# EAGLE design NIBP_Board_v1.2.0_feb2023 (EAGLE 9.6.2)

## Sheet 1 of 4: Microcontroller
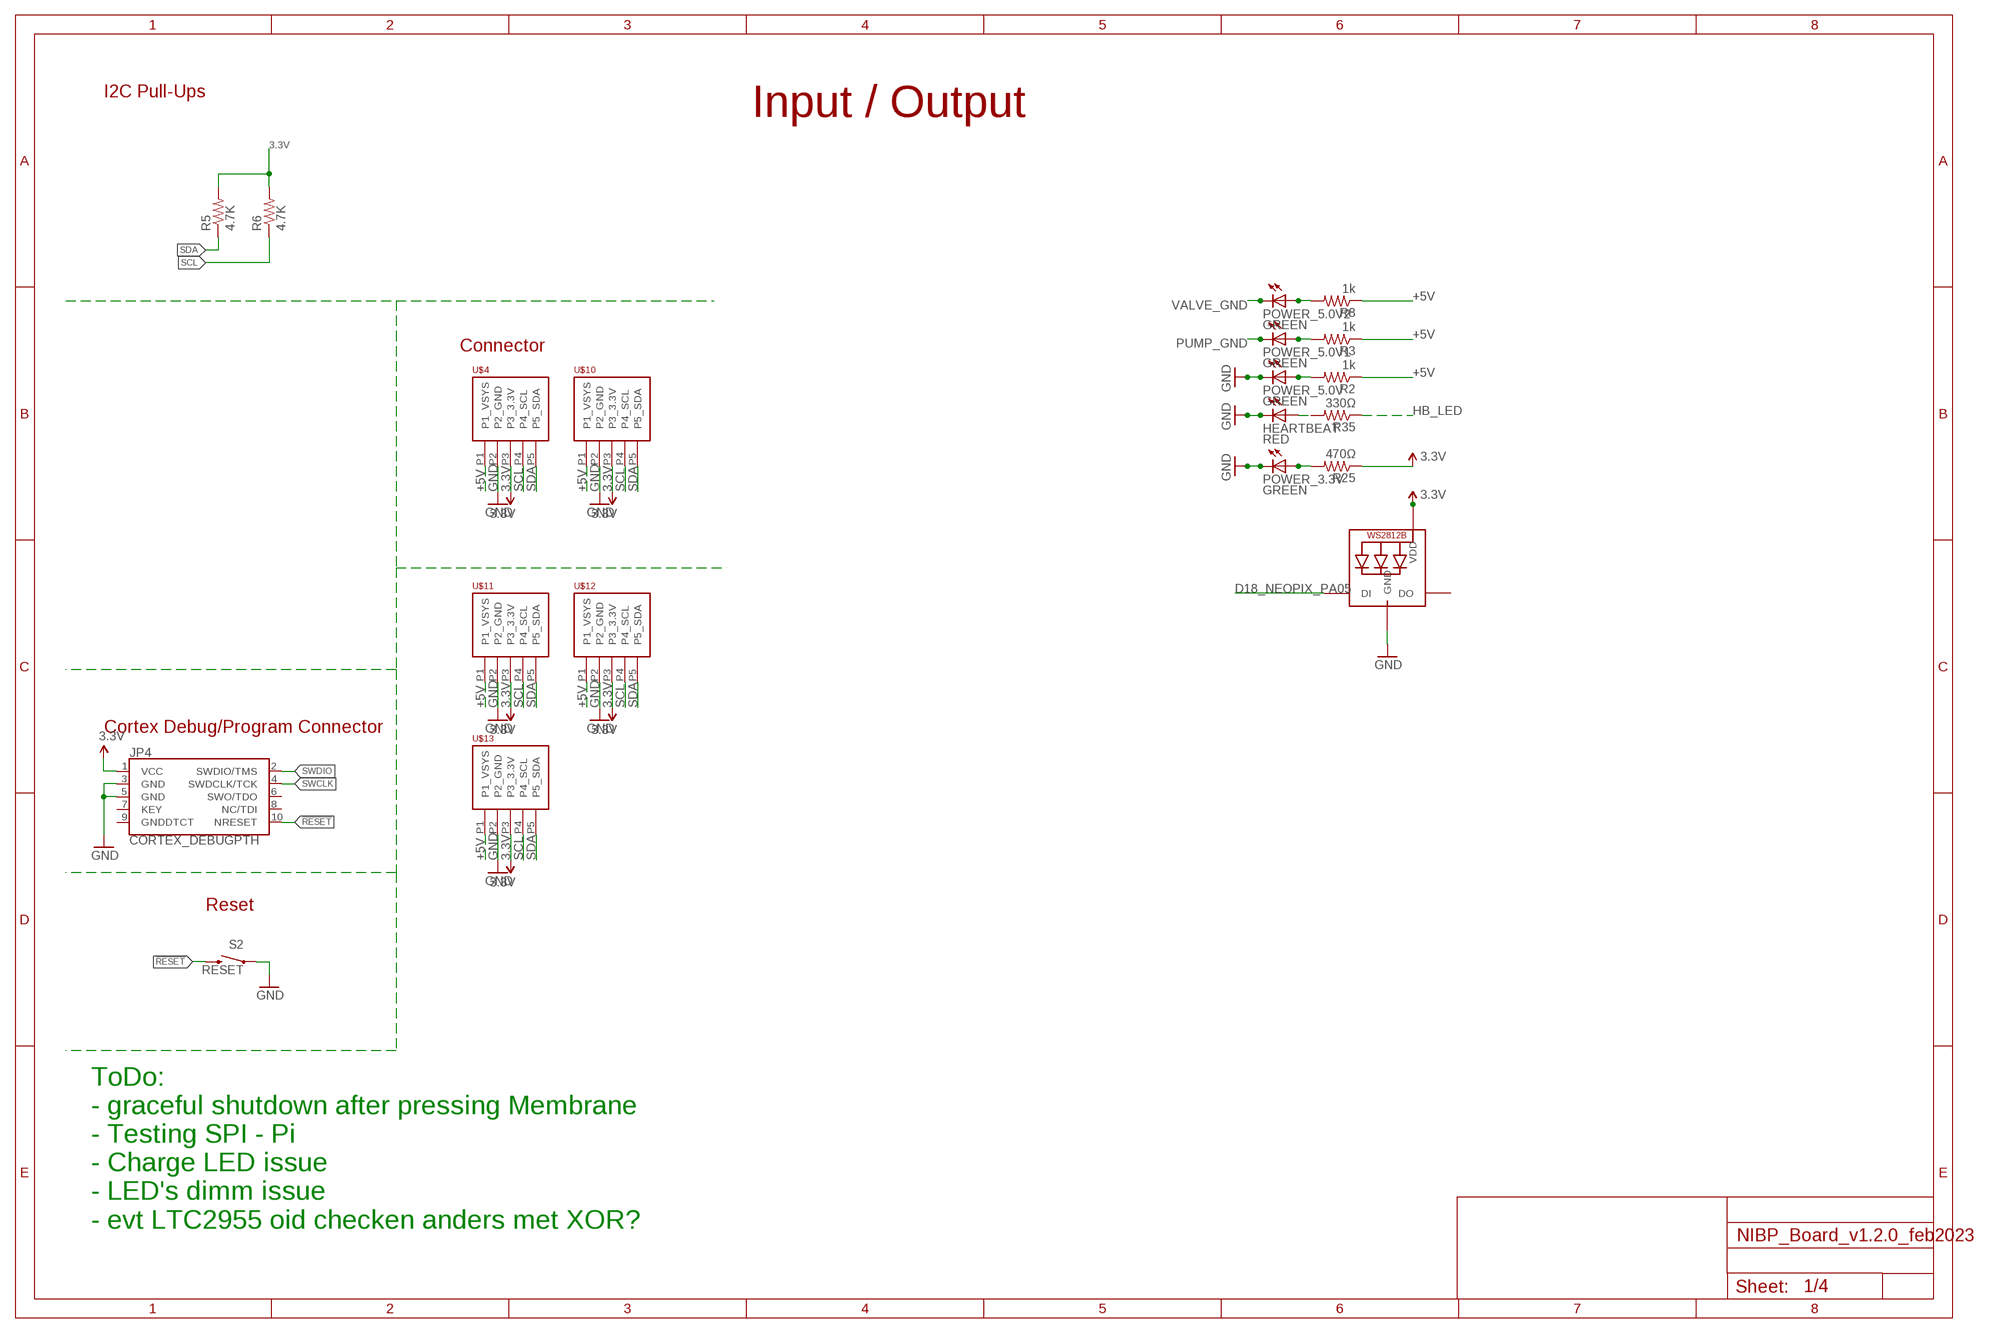
[diagram p0: schematic, sheet 1]

### Parts
HEARTBEAT  RED  LED0603  [LED-0603]
JP4  CORTEX_DEBUGPTH  [2X5-PTH-1.27MM]
LED1  WS2812B3535  [LED3535]
POWER_3.3V  GREEN  LED0603  [LED-0603]
POWER_5.0V  GREEN  LED0603  [LED-0603]
POWER_5.0V1  GREEN  LED0603  [LED-0603]
POWER_5.0V2  GREEN  LED0603  [LED-0603]
R2  1k  10KOHM-1/10W-1%(0603)0603  [0603-RES]
R3  1k  10KOHM-1/10W-1%(0603)0603  [0603-RES]
R5  4.7K  4.7KOHM-1/10W-1%(0603)  [0603-RES@1]
R6  4.7K  4.7KOHM-1/10W-1%(0603)  [0603-RES@1]
R8  1k  10KOHM-1/10W-1%(0603)0603  [0603-RES]
R25  470Ω  10KOHM-1/10W-1%(0603)0603  [0603-RES]
R35  330Ω  10KOHM-1/10W-1%(0603)0603  [0603-RES]
S2  RESET  SWITCH-MOMENTARY-2SMD-4.6X2.8MM  [TACTILE_SWITCH_SMD_4.6X2.8MM]
U$4  PHOENIX_PTSM_M5_TH  [PTSM_M5_THRHOLE]
U$10  PHOENIX_PTSM_M5_TH  [PTSM_M5_THRHOLE]
U$11  PHOENIX_PTSM_M5_TH  [PTSM_M5_THRHOLE]
U$12  PHOENIX_PTSM_M5_TH  [PTSM_M5_THRHOLE]
U$13  PHOENIX_PTSM_M5_TH  [PTSM_M5_THRHOLE]

### Nets
3.3V: JP4.1(VCC) LED1.2(VDD) R5.2 R6.2 R25.1 U$4.P3(P3_3.3V) U$10.P3(P3_3.3V) U$11.P3(P3_3.3V) U$12.P3(P3_3.3V) U$13.P3(P3_3.3V) ; also sheet 3,4
!RESET: JP4.10(NRESET) S2.3 S2.4 ; also sheet 4
+5V: R2.1 R3.1 R8.1 U$4.P1(P1_VSYS) U$10.P1(P1_VSYS) U$11.P1(P1_VSYS) U$12.P1(P1_VSYS) U$13.P1(P1_VSYS) ; also sheet 2,4
D18_NEOPIX_PA05: LED1.1(DI) ; also sheet 4
GND: HEARTBEAT.C JP4.3(GND) JP4.5(GND) LED1.4(GND) POWER_3.3V.C POWER_5.0V.C S2.1 S2.2 U$4.P2(P2_GND) U$10.P2(P2_GND) U$11.P2(P2_GND) U$12.P2(P2_GND) U$13.P2(P2_GND) ; also sheet 2,3,4
HB_LED: R35.1 ; also sheet 4
N$3: POWER_5.0V.A R2.2
N$8: POWER_5.0V1.A R3.2
N$9: POWER_5.0V2.A R8.2
N$14: POWER_3.3V.A R25.2
N$20: HEARTBEAT.A R35.2
PUMP_GND: POWER_5.0V1.C ; also sheet 2
SCL: R6.1 U$4.P4(P4_SCL) U$10.P4(P4_SCL) U$11.P4(P4_SCL) U$12.P4(P4_SCL) U$13.P4(P4_SCL) ; also sheet 4
SDA: R5.1 U$4.P5(P5_SDA) U$10.P5(P5_SDA) U$11.P5(P5_SDA) U$12.P5(P5_SDA) U$13.P5(P5_SDA) ; also sheet 4
SWCLK: JP4.4(SWDCLK/TCK) ; also sheet 4
SWDIO: JP4.2(SWDIO/TMS) ; also sheet 4
VALVE_GND: POWER_5.0V2.C ; also sheet 2
Unconnected: JP4.6(SWO/TDO) JP4.7(KEY) JP4.8(NC/TDI) JP4.9(GNDDTCT) LED1.3(DO)

### Notes on the sheet
- I2C Pull-Ups | Input / Output
- Connector
- Cortex Debug/Program Connector
- Reset
- ToDo:
  - graceful shutdown after pressing Membrane
  - Testing SPI - Pi
  - Charge LED issue
  - LED's dimm issue
  - evt LTC2955 oid checken anders met XOR?

## Sheet 2 of 4: NIBP Control
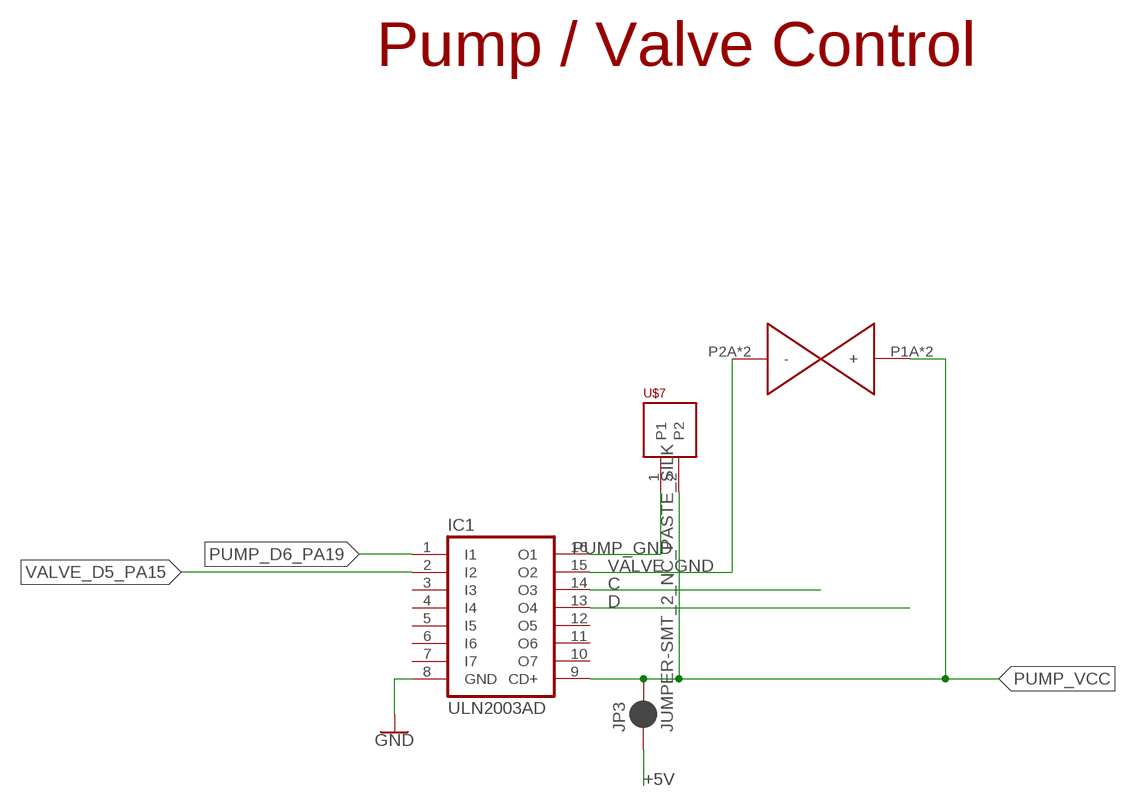
[diagram p1: schematic, sheet 2]

### Parts
IC1  ULN2003AD  [SO16]
JP3  JUMPER-SMT_2_NC_PASTE_SILK  [SMT-JUMPER_2_NC_PASTE_SILK]
U$6  VALVE_NIBP  [VALVE_NIBP]
U$7  PHOENIX_PTSM_M2TH  [PTSM_M2_THRHOLE]

### Nets
+5V: JP3.1 ; also sheet 1,4
C: IC1.14(O3)
D: IC1.13(O4)
GND: IC1.8(GND) ; also sheet 1,3,4
PUMP_D6_PA19: IC1.1(I1) ; also sheet 4
PUMP_GND: IC1.16(O1) U$7.1 ; also sheet 1
PUMP_VCC: IC1.9(CD+) JP3.2 U$6.P1A(+) U$6.P1B(+) U$7.2
VALVE_D5_PA15: IC1.2(I2) ; also sheet 4
VALVE_GND: IC1.15(O2) U$6.P2A(-) U$6.P2B(-) ; also sheet 1
Unconnected: IC1.3(I3) IC1.4(I4) IC1.5(I5) IC1.6(I6) IC1.7(I7) IC1.10(O7) IC1.11(O6) IC1.12(O5)

### Notes on the sheet
- Pump / Valve Control

## Sheet 3 of 4: Sensors
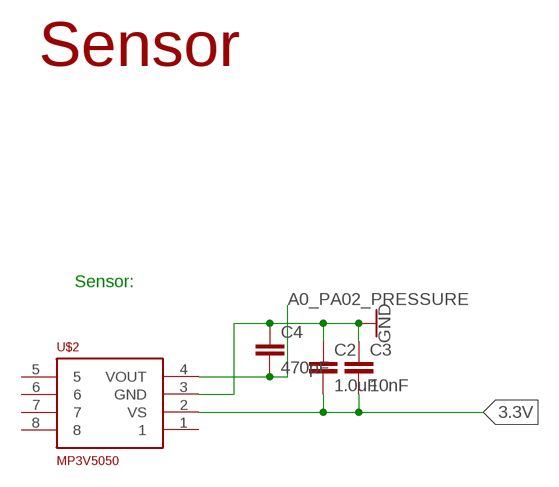
[diagram p2: schematic, sheet 3]

### Parts
C2  1.0uF  1.0UF-0603-16V-10%  [0603]
C3  10nF  10NF-0603-50V-10%  [0603]
C4  470pF  470PF-0603-50V-5%  [0603]
U$2  MP3V5050  [PRESSURE_SENSOR]

### Nets
3.3V: C2.2 C3.2 U$2.2(VS) ; also sheet 1,4
A0_PA02_PRESSURE: C4.2 U$2.4(VOUT) ; also sheet 4
GND: C2.1 C3.1 C4.1 U$2.3(GND) ; also sheet 1,2,4
Unconnected: U$2.1 U$2.5 U$2.6 U$2.7 U$2.8

### Notes on the sheet
- Sensor
- Sensor:

## Sheet 4 of 4
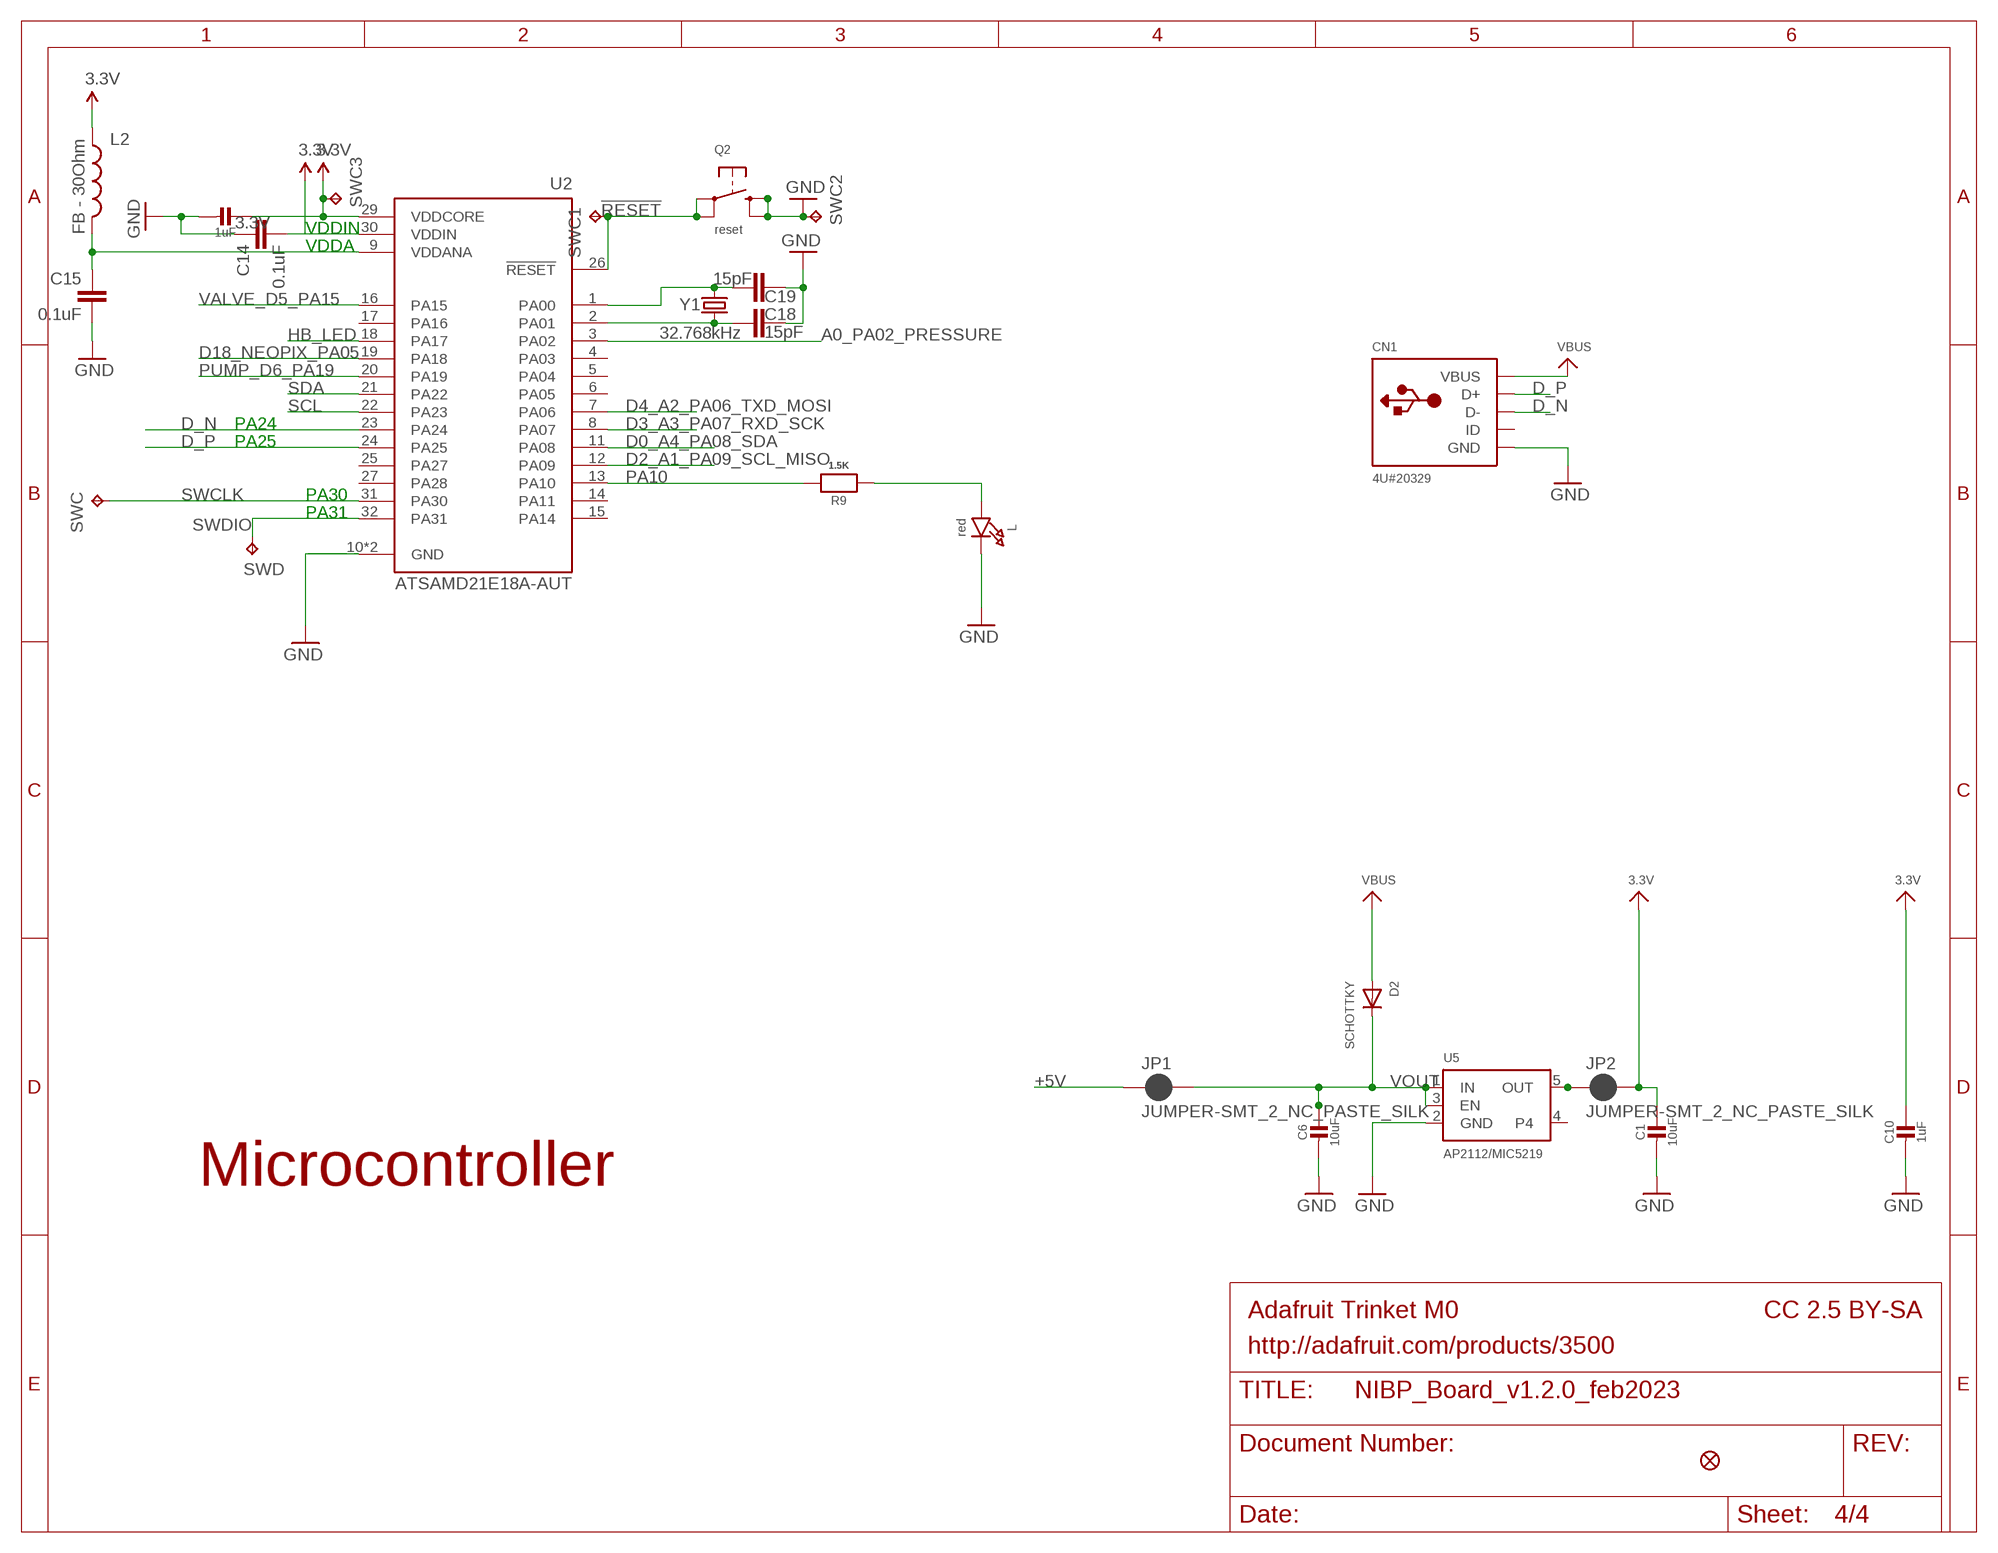
[diagram p3: schematic, sheet 4]

### Parts
C1  10uF  CAP_CERAMIC0805-NOOUTLINE  [0805-NO]
C6  10uF  CAP_CERAMIC0805-NOOUTLINE  [0805-NO]
C10  1uF  CAP_CERAMIC0603_NO  [0603-NO]
C13  1uF  CAP_CERAMIC0603_NO  [0603-NO]
C14  0.1uF  0.1UF-16V(+-10%)(0402)  [0402-CAP]
C15  0.1uF  0.1UF-16V(+-10%)(0402)  [0402-CAP]
C18  15pF  15PF-50V(+-5%)(0402)  [0402-CAP]
C19  15pF  15PF-50V(+-5%)(0402)  [0402-CAP]
CN1  4U#20329  USB_MICRO_20329_V2  [4UCONN_20329_V2]
D2  SCHOTTKY  DIODE_SOD-123FL  [SOD-123FL]
JP1  JUMPER-SMT_2_NC_PASTE_SILK  [SMT-JUMPER_2_NC_PASTE_SILK]
JP2  JUMPER-SMT_2_NC_PASTE_SILK  [SMT-JUMPER_2_NC_PASTE_SILK]
L  red  LED0603_NOOUTLINE  [CHIPLED_0603_NOOUTLINE]
L2  FB - 30Ohm  INDUCTOR0603  [0603]
Q2  reset  SWITCH_TACT_SMT4.6X2.8  [BTN_KMR2_4.6X2.8]
R9  1.5K  RESISTOR_0603_NOOUT  [0603-NO]
SWC  TPB1,27  [B1,27]
SWC1  TPB1,27  [B1,27]
SWC2  TPB1,27  [B1,27]
SWC3  TPB1,27  [B1,27]
SWD  TPB1,27  [B1,27]
U2  ATSAMD21E18A-AUT  [QFP80P900X900X120-32N]
U5  AP2112/MIC5219  VREG_SOT23-5  [SOT23-5]
U$15  FIDUCIAL_1MM  [FIDUCIAL_1MM]
Y1  32.768kHz  CRYSTAL3.2X1.5MM  [CRYSTAL-SMD-3.2X1.5MM]

### Nets
3.3V: C1.1 C10.1 C13.1 JP2.2 L2.1 SWC3.TP U2.29(VDDCORE) ; also sheet 1,3
!RESET: Q2.A'(P1) Q2.A(P) SWC1.TP U2.26(!RESET) ; also sheet 1
+5V: JP1.1 ; also sheet 1,2
A0_PA02_PRESSURE: U2.3(PA02) ; also sheet 3
D0_A4_PA08_SDA: U2.11(PA08)
D2_A1_PA09_SCL_MISO: U2.12(PA09)
D3_A3_PA07_RXD_SCK: U2.8(PA07)
D4_A2_PA06_TXD_MOSI: U2.7(PA06)
D18_NEOPIX_PA05: U2.19(PA18) ; also sheet 1
D_N: CN1.D- U2.23(PA24)
D_P: CN1.D+ U2.24(PA25)
GND: C1.2 C6.2 C10.2 C13.2 C14.1 C15.2 C18.1 C19.2 CN1.BASE@1(GND) CN1.BASE@2(GND) CN1.GND CN1.SPRT@1(GND) CN1.SPRT@2(GND) CN1.SPRT@3(GND) CN1.SPRT@4(GND) L.C Q2.B'(S1) Q2.B(S) SWC2.TP U2.10(GND) U2.28(GND) U5.2(GND) ; also sheet 1,2,3
HB_LED: U2.18(PA17) ; also sheet 1
N$11: L.A R9.1
N$12: C14.2 U2.30(VDDIN)
N$13: C18.2 U2.2(PA01) Y1.P$2
N$15: C19.1 U2.1(PA00) Y1.P$1
OUT: JP2.1 U5.5(OUT)
PA10: R9.2 U2.13(PA10)
PUMP_D6_PA19: U2.20(PA19) ; also sheet 2
SCL: U2.22(PA23) ; also sheet 1
SDA: U2.21(PA22) ; also sheet 1
SWCLK: SWC.TP U2.31(PA30) ; also sheet 1
SWDIO: SWD.TP U2.32(PA31) ; also sheet 1
VALVE_D5_PA15: U2.16(PA15) ; also sheet 2
VBUS: CN1.VBUS D2.A
VDDANA1: C15.1 L2.2 U2.9(VDDANA)
VOUT: C6.1 D2.C JP1.2 U5.1(IN) U5.3(EN)
Unconnected: CN1.ID U2.4(PA03) U2.5(PA04) U2.6(PA05) U2.14(PA11) U2.15(PA14) U2.17(PA16) U2.25(PA27) U2.27(PA28) U5.4

### Notes on the sheet
- VDDIN
- VDDA
- PA24
- PA25
- PA30
- PA31
- Microcontroller
- Adafruit Trinket M0 | CC 2.5 BY-SA
- http://adafruit.com/products/3500

## Library data of the parts
C1 C6 C10 C13 = microbuilder:CAP_CERAMIC: Ceramic Capacitors For new designs, use the packages preceded by an '_' character since they are more reliable: The following footprints should be used on most boards: _0402 - Standard footprint for regular board layouts _0603 - Standard footprint for regular board layouts _0805 - Standard footprint for regular board layouts _1206 - Standard footprint for regular board layouts For extremely tight-pitch boards where space is at a premium, the following 'micro-pitch' footprints can be used (smaller pads, no silkscreen outline, etc.): _0402MP - Micro-pitch footprint for very dense/compact boards _0603MP - Micro-pitch footprint for very dense/compact boards _0805MP - Micro-pitch footprint for very dense/compact boards _1206MP - Micro-pitch footprint for very dense/compact boards
C2 = SparkFun-Capacitors:1.0UF: 1µF ceramic capacitors A capacitor is a passive two-terminal electrical component used to store electrical energy temporarily in an electric field.; PROD_ID: CAP-00868
C3 = SparkFun-Capacitors:10NF: 0.01uF/10nF/10,000pF ceramic capacitors A capacitor is a passive two-terminal electrical component used to store electrical energy temporarily in an electric field. CAP-09321; PROD_ID: CAP-00867
C4 = SparkFun-Capacitors:470PF: 470pF ceramic capacitors A capacitor is a passive two-terminal electrical component used to store electrical energy temporarily in an electric field.; PROD_ID: CAP-07884
C14 C15 = SparkFun-Capacitors:0.1UF-16V(+-10%)(0402); PROD_ID: CAP-12416
C18 C19 = samd21-temp:15PF-50V(+-5%)(0402); PROD_ID: CAP-13063
CN1 = microbuilder:USB: USB Connectors USBMINIB - Surface Mount Female Mini-B USB Connector 4UConnector: 06564
D2 = adafruit:DIODE: Diode SMADIODE - SMA Surface Mount Package 20V 1A Schottky Diode Digikey: 641-1014-6-ND DO-1N4148 - Through Hole Small Current Diode SOD-123 20V 1 A (.5mV Vf) Schottky Diode - Digikey: MBRX120TPMSCT-ND SOD-323 10V 570mA (.38mV Vf, 3ns) Schottky Diode - Digikey: ZLLS410CT-ND SOD-523 30V 30mA Schottky Diode (RB751S-40TE61) - Digikey: RB751S-40TE61CT-ND SOT23-R/W - SOT23 Package (R = Solder Paste/Reflow Ovens, W = Hand-Soldering) BAT54Film 40V 300mA - Digikey: 497-7162-1-ND
HEARTBEAT POWER_3.3V POWER_5.0V POWER_5.0V1 POWER_5.0V2 = SparkFun:LED: LEDs Standard schematic elements and footprints for 5mm, 3mm, 1206, and 0603 sized LEDs. 5mm - Spark Fun Electronics SKU : COM-00529 (and others)
IC1 = uln-udn:ULN2003A: DRIVER ARRAY
JP1-JP3 = SparkFun-Jumpers:JUMPER-SMT_2_NC_PASTE: Normally closed solder jumper This jumper has an aperture in the stencil to allow solder paste to bridge the split in the wire so it's normally closed (NC). Wick off the solder to open the connection. Reapply solder to reclose the connection.
JP4 = samd21-temp:CORTEX_DEBUG: Cortex Debug Connector Datasheet <http://infocenter.arm.com/help/topic/com.arm.doc.faqs/attached/13634/cortex_debug_connectors.pdf>
L = microbuilder:LED: LED 0603 - 0603 Surface Mount Package 2mA: Green LED - Low Power (3.9mcd, 2ma, 1.7Vf) - Digikey: 475-2709-2-ND Orange LED - Low Power (9.8mcd, 2ma, 1.8Vf) - Digikey: 475-1194-2-ND Red LED - Low Power (5mcd, 2ma, 1.8Vf) - Digikey: 475-1195-2-ND Yellow LED - Low Power (7mcd, 2ma, 1.8Vf) - Digikey: 475-1196-2-ND 5mA: Blue LED - Low Power (17mcd, 5ma, 2.9Vf) - Digikey: LNJ937W8CRACT-ND 0805 - 0805 Surface Mount Package 2mA: Red LED (8.8mcd, 2mA, 1.8Vf, Clear) - Low Power [Digikey: 475-2510-1-ND] Green LED (5mcd, 2mA, 1.8Vf, Clear) - Low Power [Digikey: 475-2730-1-ND] Yellow LED (11.3mcd, 2mA, 1.8Vf, Clear) - Low Power [Digikey: 475-2555-1-ND] 20mA: Red LED (104mcd, 20mA, Diffused) - LS R976 [Digikey: 475-1278-6-ND] Red LED (12mcd, 20mA, 2.0Vf, Clear) - APT2012EC [Digikey: 754-1128-1-ND] Green LED (15mcd, 20mA, 2.2Vf, Clear) - APT2012GC [Digikey: 754-1131-1-ND] Orange LED (160mcd, 20mA, 2.1Vf, Clear) - APT2012SECK [Digikey: 754-1130-1-ND] 1206 - 1206 Surface Mount Package Green LED (26mcd, 20mA, Diffused) - LG N971 [Digikey: 475-1407-6-ND] Red LED (15mcd, 20mA, Diffused) - LH N974 [Digikey: 475-1416-6-ND] Cree - Cree High-Power Surface Mount LEDs XPEBWT-L1-0000-00D50 - White 111lm 350mA 2.9Vf 6200K 110° XTEAWT-00-0000-00000LEE3 - White 114lm 350mA 2.85Vf 5000K 115° Everlight - Everlight 45-21 Series Surface Mount LEDs 45-21/QK2C-B2832AC2CB2/2T - Warm White 2000mcd 20mA 3.25Vf 3050K 120° 45-21/LK2C-B38452C4CB2/2T - Nuetral White 2000mcd 20mA 3.25Vf 4150K 120° 45-21/LK2C-B50634C6CB2/2T - Cold White 2200mcd 20mA 3.25Vf 5650K 120° PLCC2 Reverse Mount LS T77K-J1L2-1-0-2-R18-Z - Red 11.25mcd 2mA 1.8Vf 630nm 120° LO T77K-L1M2-24-Z - Orange 19.6mcd 2mA 1.8Vf 606nm 120° LY T77K-K2M1-26-Z - Yellow 15.7mcd 2mA 1.8Vf 587nm 120°
L2 = SparkFun-Passives:INDUCTOR: Inductors Basic Inductor/Choke - 0603 and 1206. Footprints are not proven and vary greatly between part numbers. INDUCTOR POWER 3.3UH 4.0A SMD 0.197" L x 0.197" W x 0.177" H (5.00mm x 5.00mm x 4.50mm); PROD_ID: RES-07859
LED1 = microbuilder:WS2812B
Q2 = microbuilder:SWITCH_TACT_SMT: SMT Tact Switches 6x6mm - Digikey: P12940SCT-ND KMR2 (4.6x2.8mm) - Digikey: 401-1426-1-ND EVQ-PQHB55 - Light Touch, 160GF (4.5x4.5mm) - Digikey: P8090SCT-ND KMT0 - KMT021 NGJ LHS (etc.) IP68/Waterproof - Digikey: CKN10289CT-ND
R2 R3 R8 R25 R35 = SparkFun-Resistors:10KOHM-1/10W-1%(0603): RES-00824; PROD_ID: RES-00824; VALUE: 10K
R5 R6 = SparkFun-Resistors:4.7KOHM-1/10W-1%(0603): RES-07857; PROD_ID: RES-07857
R9 = microbuilder:RESISTOR: Resistors For new designs, use the packages preceded by an '_' character since they are more reliable: The following footprints should be used on most boards: _0402 - Standard footprint for regular board layouts _0603 - Standard footprint for regular board layouts _0805 - Standard footprint for regular board layouts _1206 - Standard footprint for regular board layouts For extremely tight-pitch boards where space is at a premium, the following 'micro-pitch' footprints can be used (smaller pads, no silkscreen outline, etc.): _0402MP - Micro-pitch footprint for very dense/compact boards _0603MP - Micro-pitch footprint for very dense/compact boards _0805MP - Micro-pitch footprint for very dense/compact boards _1206MP - Micro-pitch footprint for very dense/compact boards
S2 = samd21-temp:SWITCH-MOMENTARY-2: Various NO switches- pushbuttons, reed, etc; PROD_ID: SWCH-13065
SWC SWC1-SWC3 SWD = testpad:TP: Test pad
U2 = ATSAMD21E18A-AUT:ATSAMD21E18A-AUT: ARM Cortex-M0+ SAM D21E Microcontroller IC 32-Bit 48MHz 256KB (256K x 8) FLASH 32-TQFP (7x7) Check availability <https://pricing.snapeda.com/parts/ATSAMD21E18A-AU/Microchip/view-part?ref=eda>; AVAILABILITY: In Stock; DESCRIPTION: ARM® Cortex®-M0+ SAM D21E, Functional Safety (FuSa) Microcontroller IC 32-Bit Single-Core 48MHz 256KB (256K x 8) FLASH 32-TQFP (7x7); MF: Microchip; MP: ATSAMD21E18A-AU; PACKAGE: TQFP-32 Microchip; PRICE: None; PURCHASE-URL: https://pricing.snapeda.com/search/part/ATSAMD21E18A-AU/?ref=eda
U5 = microbuilder:VREG_SOT23-5: SOT23-5 Fixed Voltage Regulators Part Current Out V Out V In V Dropout θJA (°C/W) TJ (°C) Digikey Part No. ADP121 150mA 3.3V 3.4-5.5V 0.09V @ 150mA -- -- ADP121-AUJZ33R7CT-ND ADP121 150mA 3.0V 3.1-5.5V 0.09V @ 150mA -- -- ADP121-AUJZ30R7CT-ND ADP122 300mA 3.3V 3.4-5.5V 0.085V @ 300mA -- -- ADP122AUJZ-3.3-R7CT-ND ADP1712 300mA 3.3V 3.5-5.5V 0.17V @ 300mA -- -- ADP1712AUJZ-3.3-R7TR-ND AP7311 (Low Cost) 150mA 3.3V 3.5-6V 0.15V @ 150mA -- -- AP7311-33WG-7DICT-ND LD39015M18R 150mA 1.8V 1.9V-5.5V 0.08V @ 100mA -- -- 497-6977-1-ND LP2985A-33DBVR 150mA 3.3V 3.3-16V 0.28V @ 150mA 206 150 296-18479-1-ND MCP1824T-3302E/OT 300mA 3.3V 3.5V-6V 0.2V @ 300mA -- -- MCP1824T-3302E/OTCT-ND MIC5205-2.5YM5 TR 150mA 2.5V 2.7-16V 0.165V @ 150mA -- -- 576-1257-2-ND MIC5205-3.0YM5 TR 150mA 3.0V 3.2V-16V 0.165V @ 150mA -- -- 576-1258-2-ND MIC5205-3.3YM5 TR 150mA 3.3V 3.5V-16V 0.165V @ 150mA -- -- 576-1259-2-ND TPS780330220 150mA 3.3V+2.2V 3.6-5.5V 250mV Max -- -- 296-23332-1-ND TDA3663/N1,135 100mA 3.3V 3.5-45V 0.18V @ 50mA -- -- 568-5343-1-ND Max operating temp can be calculated using θJA, TJ (max junction temperature), and power in watts. Set the "Maximum Ambient Temperature" until it reaches TJ ("Max Junction Temperature"), which is the absolute limit for safe use of the regulator: Heat Sink Temperature Calculator <http://www.daycounter.com/Calculators/Heat-Sink-Temperature-Calculator.phtml> For example, With 12V source into a 3.3V LP2985 and a 30mA load, we are dissipating (12V-3.3V) * 0.03A = 0.261W. With a θJA of 206 °C/W, a TJ of 150°C, and 261mW we can safely use the chip without a heat sink up to 75°C (=147.1°C Junction Temperature).
U$2 = jk_customs:MP3V5050: MP3V5050 Datasheet <https://nl.mouser.com/datasheet/2/302/MP3V5050-1127012.pdf>
U$4 U$10-U$13 = jk_customs:PHOENIX_PTSM_M5_TH: Datasheet Phoenix PTSM 0,5/ 5-HH-2,5-THR R32 <https://www.phoenixcontact.com/online/portal/us?uri=pxc-oc-itemdetail:pid=1778654&library=usen&pdfmode=direct&pdflanguage=en>
U$6 = jk_customs:VALVE_NIBP
U$7 = jk_customs:PHOENIX_PTSM_M2
U$15 = microbuilder:FIDUCIAL: Fiducial Alignment Points Various fiducial points for machine vision alignment.; BOM: EXCLUDE
Y1 = samd21-temp:CRYSTAL: Various standard crystals. Proven footprints.; PROD_ID: XTAL-13062

## Board
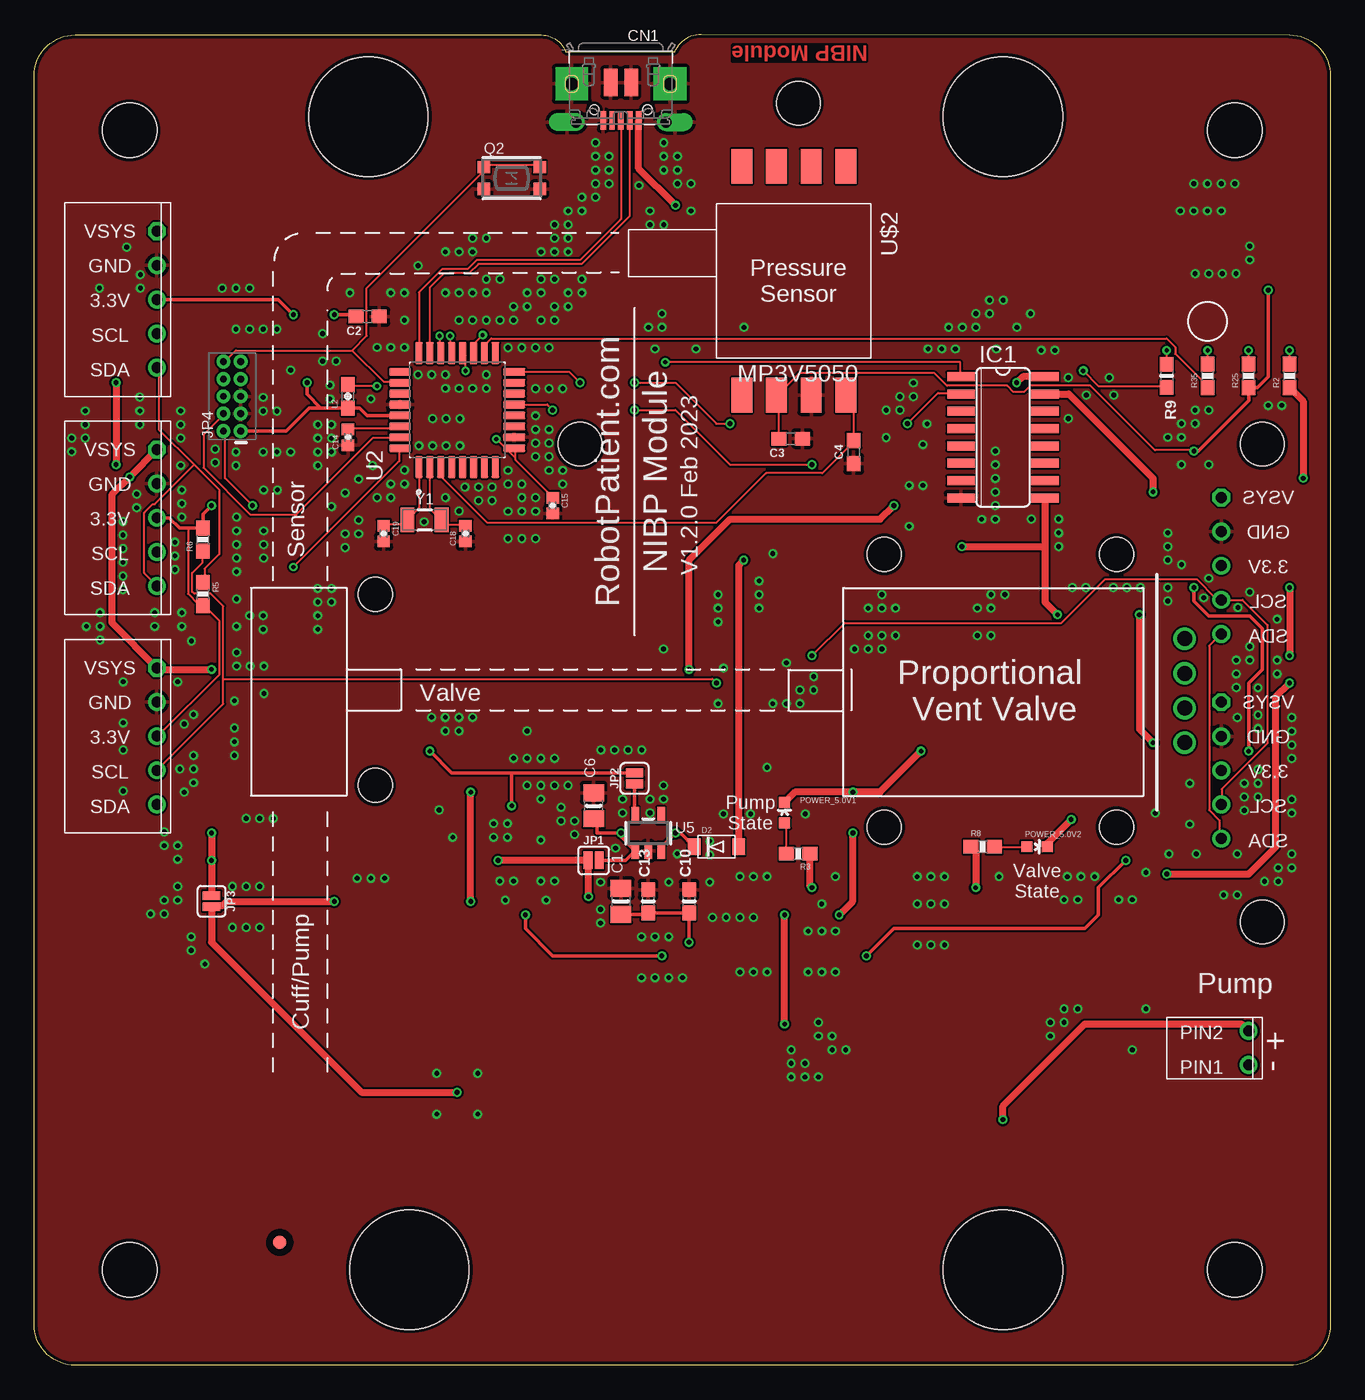
[diagram p4: board, top side]
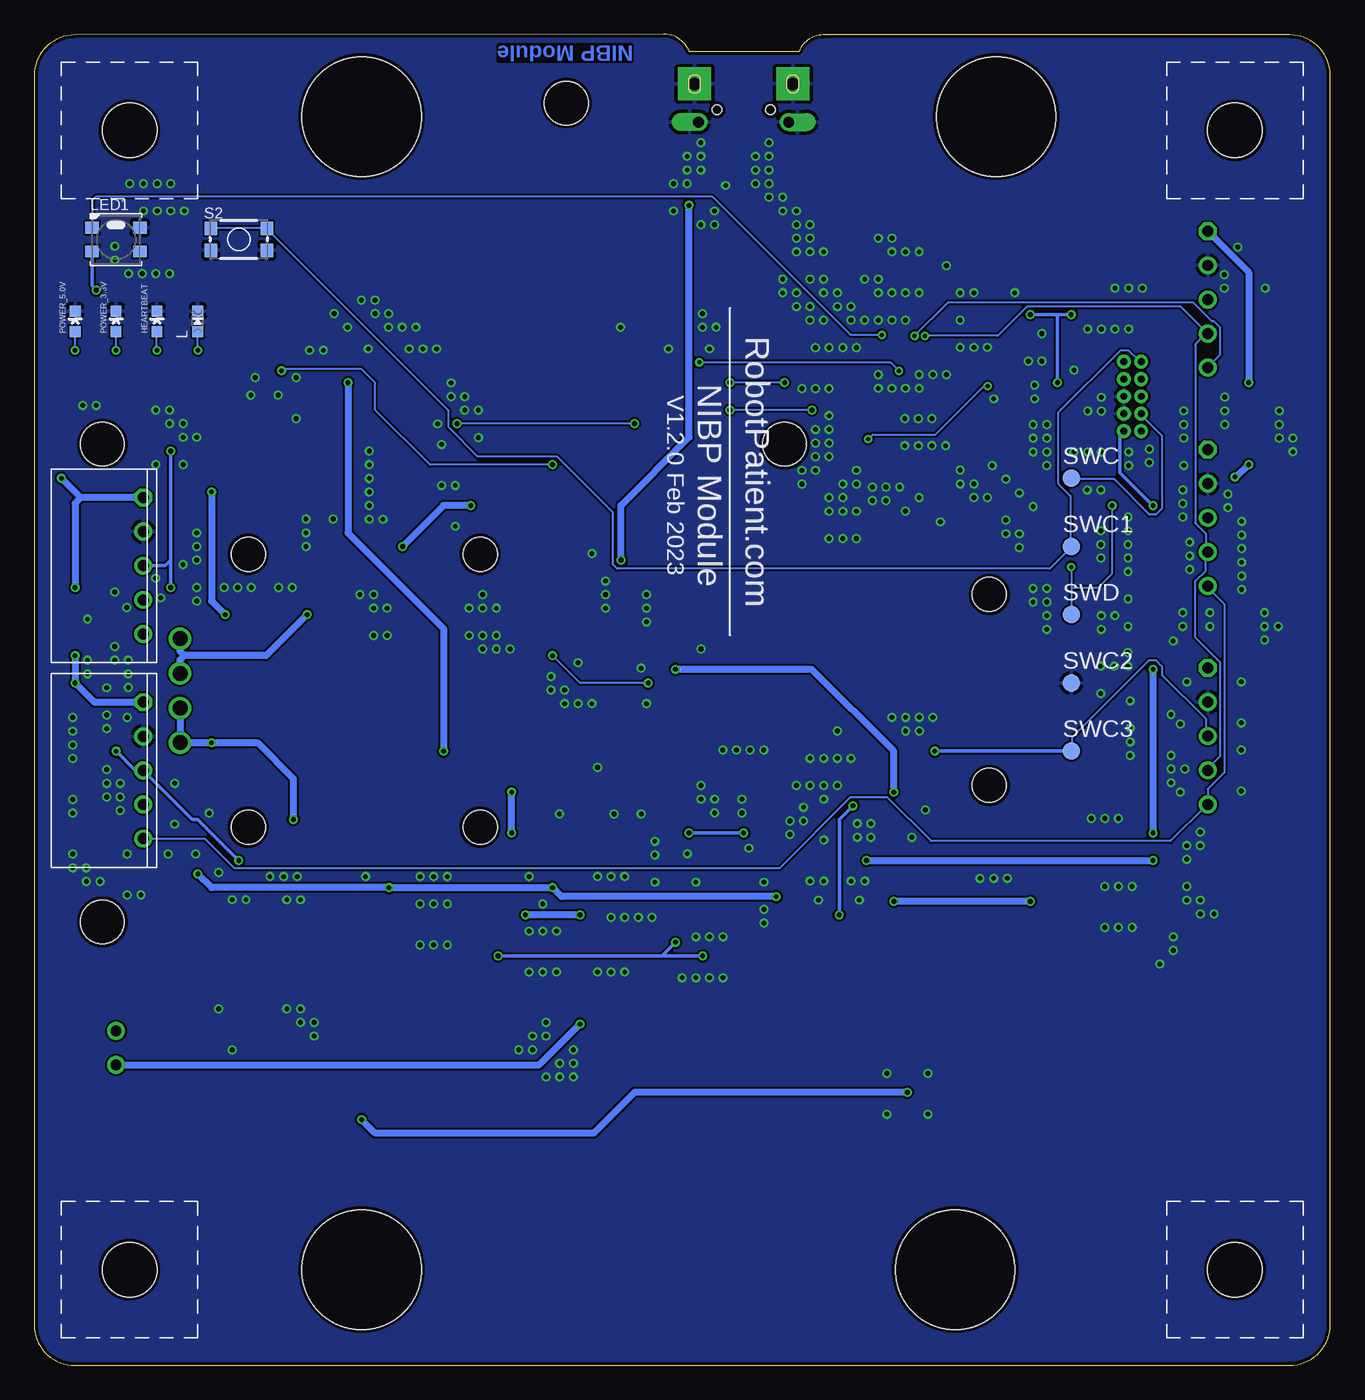
[diagram p5: board, bottom side, seen from below]

Size 95 x 97.56 mm. Coordinates in mm from the lower left corner, seen from the top.
Outline: 0,3.01 0,94.5 arc-90 3,97.5 37.15,97.5 arc-68 38.96,96.27 46.96,96.28 arc-67 48.89,97.56 92,97.5 arc-90 95,94.5 95,3 arc-90 92,0 3,0.01 arc-90 0,3.01
Copper layers (1*16): Top 0.035mm / dielectric 1.5mm / Bottom 0.035mm
Design rules "SeeedStudio_2layer_DRU_no_angle_20140221": minimum track width 6mil, minimum drill 12mil, track to track 6mil, track to pad 6mil, pad to pad 6mil, via to via 6mil, smd to smd 0mil, copper to edge 10mil, drill to drill 10mil, minimum pad ring 10mil, minimum via ring 6mil, stop-mask expansion 2mil, vias tented up to drill 100mil, thermal gap 10mil
Holes 8.75 mm at 24.5,91.51 27.5,7.01 71,91.51 71,7.01
Holes 3.2 mm at 56,92.5 90,67.5 40,67.5 90,32.5
Holes 2.5 mm at 25,56.5 25,42.5

### Footprints (pad centres in the part's own frame; a part is rotated, then mirrored left to right if it is on the bottom)
0805-NO = smd 1.24 x 1.5: 1 -0.95,0; 2 0.95,0
0603 = smd 1.1 x 1: 1 -0.85,0; 2 0.85,0
0603-NO = smd 1.075 x 1: 1 -0.85,0; 2 0.85,0
0402-CAP = smd 0.85 x 0.9: 1 -0.58,0; 2 0.58,0
4UCONN_20329_V2 = smd 1 x 2: BASE@1 -0.75,-2; BASE@2 0.75,-2 | smd 0.4 x 1.35: D+ 0,0.775; D- -0.65,0.775; GND 1.3,0.775; ID 0.65,0.775; VBUS -1.3,0.775 | drill 0.8 pad 1.143 offset: SPRT@1 -3.3,0.9; SPRT@2 3.3,0.9 | drill 0.9 pad 2.413 square: SPRT@3 -3.6,-1.9; SPRT@4 3.6,-1.9 | hole 0.7: -1.95,0; 1.95,0
SOD-123FL = smd 0.91 x 1.22: A 1.637,0; C -1.637,0
LED-0603 = smd 0.8 x 0.8: A 0,-0.75; C 0,0.75
SO16 = smd 0.66 x 2.032: 1 -4.445,-3.073; 2 -3.175,-3.073; 3 -1.905,-3.073; 4 -0.635,-3.073; 5 0.635,-3.073; 6 1.905,-3.073; 7 3.175,-3.073; 8 4.445,-3.073; 9 4.445,3.073; 10 3.175,3.073; 11 1.905,3.073; 12 0.635,3.073; 13 -0.635,3.073; 14 -1.905,3.073; 15 -3.175,3.073; 16 -4.445,3.073
SMT-JUMPER_2_NC_PASTE_SILK = smd 0.635 x 1.27: 1 -0.406,0; 2 0.406,0
2X5-PTH-1.27MM = drill 0.508 pad 1: 1 -2.54,-0.635; 2 -2.54,0.635; 3 -1.27,-0.635; 4 -1.27,0.635; 5 0,-0.635; 6 0,0.635; 7 1.27,-0.635; 8 1.27,0.635; 9 2.54,-0.635; 10 2.54,0.635
CHIPLED_0603_NOOUTLINE = smd 0.8 x 0.8: A 0,-0.75; C 0,0.75
LED3535 = smd 1 x 0.85: 1 -1.75,0.875; 2 -1.75,-0.875; 3 1.75,-0.875; 4 1.75,0.875
BTN_KMR2_4.6X2.8 = smd 0.9 x 0.9: A 2.05,0.8; A' -2.05,0.8; B 2.05,-0.8; B' -2.05,-0.8
0603-RES = smd 1.1 x 1: 1 -0.85,0; 2 0.85,0
0603-RES@1 = smd 1.1 x 1: 1 -0.85,0; 2 0.85,0
TACTILE_SWITCH_SMD_4.6X2.8MM = smd 0.9 x 1: 1 -2.05,-0.8; 2 2.05,-0.8; 3 2.05,0.8; 4 -2.05,0.8
B1,27 = smd 1.27 x 1.27: TP 0,0
QFP80P900X900X120-32N = smd 1.6 x 0.55: 1 -4.18,2.8; 2 -4.18,2; 3 -4.18,1.2; 4 -4.18,0.4; 5 -4.18,-0.4; 6 -4.18,-1.2; 7 -4.18,-2; 8 -4.18,-2.8; 17 4.18,-2.8; 18 4.18,-2; 19 4.18,-1.2; 20 4.18,-0.4; 21 4.18,0.4; 22 4.18,1.2; 23 4.18,2; 24 4.18,2.8 | smd 0.55 x 1.6: 9 -2.8,-4.18; 10 -2,-4.18; 11 -1.2,-4.18; 12 -0.4,-4.18; 13 0.4,-4.18; 14 1.2,-4.18; 15 2,-4.18; 16 2.8,-4.18; 25 2.8,4.18; 26 2,4.18; 27 1.2,4.18; 28 0.4,4.18; 29 -0.4,4.18; 30 -1.2,4.18; 31 -2,4.18; 32 -2.8,4.18
SOT23-5 = smd 0.55 x 1.2: 1 -0.95,-1.3; 2 0,-1.3; 3 0.95,-1.3; 4 0.95,1.3; 5 -0.95,1.3
PRESSURE_SENSOR = smd 2.54 x 1.52: 1 8.38,-3.81; 2 8.38,-1.27; 3 8.38,1.27; 4 8.38,3.81; 5 -8.38,3.81; 6 -8.38,1.27; 7 -8.38,-1.27; 8 -8.38,-3.81
WA-SNAD = hole 4: 0,0
PTSM_M5_THRHOLE = drill 0.8 octagon: P1 12.1,1 | drill 0.8: P2 9.6,1; P3 7.1,1; P4 4.6,1; P5 2.1,1
VALVE_NIBP = drill 1.1: P1A 0,3.81; P1B 0,1.27; P2A 0,-1.27; P2B 0,-3.81 | hole 2.5: -22,10; -5,10; -5,-10; -22,-10
PTSM_M2_THRHOLE = drill 0.8: 1 1,1; 2 3.5,1
FIDUCIAL_1MM = smd 1 x 1: 1 0,0
CRYSTAL-SMD-3.2X1.5MM = smd 1 x 1.8: P$1 -1.25,0; P$2 1.25,0

### Placement (x,y rotation side)
C1  43,34.01 90 top
C2  24.44,76.86 180 top
C3  55.44,67.91 180 top
C4  60.06,66.93 90 top
C6  41,41.01 90 top
C10  48,34.01 90 top
C13  45,34.01 90 top
C14  23,68.01 90 top
C15  38,63.01 270 top
C18  31.61,60.96 90 top
C19  25.61,60.96 270 top
CN1  43,92.01 180 top
D2  50,38.01 0 top
HEARTBEAT  86,76.51 0 bottom
IC1  71,68.01 270 top
JP1  41,37.01 0 top
JP2  44,43.01 90 top
JP3  13,34.01 270 top
JP4  14.51,71.01 90 top
L  83,76.51 0 bottom
L2  23,71.01 90 top
LED1  89,82.5 0 bottom
POWER_3.3V  89,76.51 0 bottom
POWER_5.0V  92,76.51 0 bottom
POWER_5.0V1  55,40.5 0 top
POWER_5.0V2  73.49,38.01 270 top
Q2  35,87.01 0 top
R2  92,72.51 90 top
R3  56,37.5 180 top
R5  12.36,56.53 270 top
R6  12.38,60.51 90 top
R8  69.51,38.01 0 top
R9  83,72.51 270 top
R25  89,72.51 90 top
R35  86,72.51 90 top
S2  80,82.52 0 bottom
SWC  19,65.01 0 bottom
SWC1  19,60.01 0 bottom
SWC2  19,50.01 0 bottom
SWC3  19,45.01 0 bottom
SWD  19,55.01 0 bottom
U2  31,70.01 90 top
U5  45,39.01 0 top
U$2  55.68,79.49 270 top
U$3  WA-SNAD  [WA-SNAD]  88,7.01 0 top
U$4  86,36.5 90 bottom
U$5  WA-SNAD  [WA-SNAD]  7,90.51 0 top
U$6  84.31,49.44 0 top
U$7  90,21.01 90 top
U$9  WA-SNAD  [WA-SNAD]  7,7.01 0 top
U$10  86,51.5 90 bottom
U$11  10,55.01 90 top
U$12  10,71.01 90 top
U$13  10,39.01 90 top
U$15  18,9.01 0 top
U$40  WA-SNAD  [WA-SNAD]  88,90.51 0 top
Y1  28.61,61.96 0 top

### Tracks (layer width: path | path; a pad name or v marks a point on that pad's centre or on a via)
3.3V  (via drill 0.35)
  Top 0.152: 11.28,61.36 11.28,56.55 12.04,55.79 12.34,55.79 R5.2 12.5,55.64 13.56,54.57 13.56,50.61 9.14,46.19 U$13.P3 | C3.2 54.56,67.98 54.56,71.03 U$2.2 54.56,71.18 56.08,72.7 65.99,72.7 66.9,71.79 71.32,71.79 71.78,71.33 72.54,71.33 73,71.79 77.42,71.79 82.14,67.07 84.89,67.07 v85,67.01
  Top 0.254: JP4.1 18.46,68.47 20.15,70.16 21,70.16 | 21,70.16 L2.1 23.85,70.16 24.4,69.61 U2.29 | U$11.P3 9.9,62.11 10.65,61.36 11.28,61.36 R6.2 12.38,62.39 v13,63.01 | U$12.P3 17.9,78.11 v19,77.01 | v22,77.01 23.44,77.01 C2.2 | 21,70.16 20,71.16 v20,72.01 | v90.44,78.8 90.44,72.45 89.65,71.66 R25.1 89,70.71 85.3,67.01 v85,67.01 | v85,57.01 85,56.01 86.1,54.91 89.1,54.91 90,54.01 90,51.01 89,50.01 v89,45.01 | v80,37.01 78,35.01 78,33.01 77,32.01 63,32.01 v61,30.01 | v48,31.01 C10.1 C13.1 44.9,33.06 C1.1 | JP2.2 35,43.42 | 35,43.42 30.59,43.42 v29,45.01 | v46,30.01 38,30.01 36,32.01 v36,33.01 | v35,41.01 35,43.42
  Bottom 0.152: U$13.P3 9.14,46.19 9.14,47.41 12.34,50.61 12.34,51.22 12.8,51.67 13.26,51.67 18.9,46.03 18.9,45.12 SWC3.TP
  Bottom 0.254: JP4.1 15.43,68.19 15.43,65.43 v13,63.01 | v19,77.01 20,77.01 | 20,77.01 v22,77.01 | v20,72.01 20,77.01 | LED1.2 90.75,79.11 v90.44,78.8 | v85,67.01 85,59.01 | 85,59.01 85.41,58.6 U$10.P3 | 85,59.01 v85,57.01 | v89,45.01 87.59,43.6 U$4.P3 83.41,40.01 83,40.01 v80,37.01 | v61,30.01 49,30.01 | 49,30.01 v46,30.01 | v48,31.01 49,30.01 | v29,45.01 SWC3.TP | v36,33.01 36,40.01 v35,41.01
!RESET
  Top 0.152: Q2.A 37.03,87.94 33.07,87.94 Q2.A' 32.92,87.79 32.92,87.49 24.38,78.95 24.38,75.45 23.32,74.38 | 23.32,74.38 25.6,72.09 26.67,72.09 U2.26 | 23.32,74.38 14.78,74.38 14.02,73.62 JP4.10
  Bottom 0.152: S2.4 81.99,83.37 78.03,83.37 S2.3 77.88,83.22 64.62,69.96 64.62,68.74 62.48,66.61 56.69,66.61 52.58,62.49 52.58,58.68 52.27,58.38 20.57,58.38 19.05,59.9 SWC1.TP 19.05,60.06 19.05,63.71 19.96,64.63 19.96,69.81 15.39,74.38 14.78,74.38 14.02,73.62 JP4.10
+5V  (via drill 0.35)
  Top 0.508: JP3.1 v13,37.01 v13,39.01 | v34,37.01 JP1.1 40.59,34.38 v40.62,34.35 | v13,51.01 9.1,51.01 U$13.P1 5.69,54.42 5.69,63.8 v7,65.11 U$11.P1 | v57,35.01 56.85,35.16 R3.1 | R8.1 69,37.67 v69,35.01 | v83,36.01 89,36.01 91,38.01 91,49.01 v92,50.01 | v92,57.01 v92,52.01 | R2.1 93,70.66 v93,65.01 | v6,72.01 v6,66.01
  Bottom 0.508: v34,37.01 v13,37.01 | v13,51.01 v13,39.01 | v40.62,34.35 56.34,34.35 v57,35.01 v69,35.01 82,35.01 v83,36.01 | U$4.P1 90.59,48.6 v92,50.01 v92,52.01 | U$10.P1 91.59,63.6 | 91.59,63.6 v93,65.01 | 91.59,63.6 92,63.19 v92,57.01 | U$12.P1 6,80.11 v6,72.01 | v6,66.01 7,65.01 v7,65.11
A0_PA02_PRESSURE
  Top 0.152: U$2.4 59.59,71.03 60.05,70.57 60.05,67.83 C4.2 60.05,67.68 57.76,65.39 53.65,65.39 49.99,61.73 33.22,61.73 29.87,65.08 29.87,65.69 U2.3
D18_NEOPIX_PA05  (via drill 0.3)
  Top 0.152: v32.88,75.51 32.25,74.88 32.25,74.26 U2.19
  Bottom 0.152: v32.88,75.51 35.16,75.51 45.28,85.63 90.5,85.63 90.75,85.38 LED1.1
D_N
  Top 0.152: U2.23 29,79.01 30,80.01 30.37,80.01 30.39,80.03 31.89,80.03 32.56,80.7 40.13,80.7 43.65,84.23 CN1.D-
D_P
  Top 0.152: U2.24 28.2,78.64 29.9,80.34 31.76,80.34 32.43,81.01 40,81.01 43,84.01 CN1.D+
GND  (via drill 0.35)
  other vias: 11,42.01 11,47.01 10.53,50.09 11.53,53.09 8.83,55.16 8.83,54.16 4.83,55.16 4.83,54.16 4.83,53.16 3.83,54.16 10.83,55.16 10.83,54.16 14.83,54.16 10.83,64.16 10.83,63.16 10.83,62.16 10.75,65.95 10.75,67.95 10.75,68.95 10.75,69.95 7.75,70.95 7.75,69.95 7.75,68.95 3.75,68.95 3.75,69.95 3.75,67.95 2.75,67.95 2.75,66.95 14.79,66.94 14.79,65.94 17.79,75.94 16.79,75.94 15.79,75.94 14.79,75.94 18.79,72.94 17.79,69.94 16.79,70.94 16.79,69.94 16.79,66.94 17.79,66.94 18.79,66.94 20.79,66.94 21.79,66.94 21.79,67.94 20.79,67.94 20.79,65.94 24.79,65.94 23.79,64.94 22.79,63.94 21.79,62.94 22.79,59.94 22.79,60.94 23.79,60.94 23.79,61.94 21.79,56.94 21.79,55.94 20.79,55.94 20.79,56.94 20.79,54.94 20.79,53.94 16.79,53.94 16.79,54.94 15.79,54.94 14.83,56.16 14.83,58.16 16.83,60.16 16.83,59.16 16.83,61.16 16.83,64.16 17.83,64.16 14.83,62.16 14.83,61.16 14.83,60.16 14.83,59.16 10.32,60.32 10.32,59.32 10.32,58.32 11.68,47.7 11.68,44.7 11.68,43.7 10.68,43.7 11.68,42.7 14.68,44.7 14.68,45.7 14.68,46.7 14.68,48.7 16.84,49.24 16.84,51.24 15.84,51.24 14.84,51.24 14.84,52.24 24.68,35.7 23.68,35.7 25.68,35.7 30.68,38.7 29.68,40.7 33.68,39.7 34.68,39.7 33.68,38.7 34.68,38.7 37.13,38.49 37.13,41.49 36.13,42.49 37.13,42.49 38.13,42.49 38.13,44.49 37.13,44.49 36.13,44.49 35.13,44.49 32.13,47.49 36.13,46.49 31.13,46.49 31.13,47.49 30.13,47.49 30.13,46.49 29.13,47.49 46.13,52.49 50.13,54.49 50.13,55.49 50.13,56.49 53.13,57.49 53.13,56.49 53.13,55.49 54.13,59.49 60.13,52.49 61.13,52.49 62.13,52.49 61.13,53.49 62.13,53.49 63.13,53.49 63.13,55.49 62.13,56.49 62.13,55.49 61.13,55.49 71.13,56.49 70.13,56.49 69.13,55.49 70.13,55.49 70.13,53.49 69.13,53.49 13.27,67.15 13.27,66.15 7.51,63.85 7.51,62.85 6.51,61.85 6.51,60.85 6.51,59.85 6.51,58.85 6.51,57.85 6.51,56.85 6.53,50.09 6.53,47.09 6.53,45.09 6.53,42.09 14.53,35.09 15.53,35.09 16.53,35.09 10.53,35.09 9.53,34.09 10.53,34.09 9.53,33.09 8.53,33.09 10.53,38.09 10.53,37.09 9.53,38.09 9.53,39.09 15.53,40.09 16.53,40.09 17.53,40.09 16.53,32.09 15.53,32.09 14.53,32.09 34.53,34.09 37.53,34.09 42.53,45.09 43.53,45.09 44.53,45.09 50.53,51.09 50.13,48.49 55.13,51.49 57.13,50.49 57.13,49.49 56.13,49.49 56.13,48.49 55.13,48.49 54.13,48.49 65.13,67.49 62.44,68 63.44,70 62.44,70 63.44,71 64.44,71 64.44,72 65.44,69 70.44,67 70.44,66 70.44,65 70.44,64 70.44,63 69.44,62 70.44,62 73.08,62.01 75.08,62.01 75.08,60.01 75.08,61.01 79.08,57.01 80.08,57.01 81.08,57.01 77.08,57.01 76.08,57.01 83.08,59.01 83.08,60.01 83.08,61.01 83.08,57.01 83.08,56.01 84.08,68.01 84.08,66.01 86.08,66.01 85.08,69.01 84.08,69.01 83.08,68.01 85.08,70.01 86.08,70.01 85.08,80.01 86.08,80.01 87.08,80.01 88.08,80.01 89.08,81.01 89.08,82.01 84.99,84.6 85.99,84.6 86.99,84.6 83.99,84.6 84.99,86.6 85.99,86.6 86.99,86.6 87.99,86.6 90.44,70.35 91.44,70.35 86.09,57.68 84.09,58.68 89.09,56.68 91.09,54.68 89.09,52.68 89.09,51.68 88.09,51.68 88.09,50.68 88.09,49.68 91.09,50.68 91.09,51.68 89.69,49.66 89.69,47.66 89.69,46.66 89.69,43.66 89.69,42.66 89.69,41.66 88.69,42.66 88.69,41.66 88.69,40.66 84.69,39.66 84.69,42.66 88.17,47.47 92.17,47.47 92.17,46.47 92.17,45.47 92.17,44.47 92.17,41.47 92.17,40.47 92.17,37.47 92.17,36.47 91.17,36.47 91.17,35.47 90.17,35.47 88.17,34.47 87.17,34.47 88.17,37.47 85.17,37.47 83.17,37.47 82.17,40.47 81.48,36.13 80.48,34.13 79.48,34.13 76.48,34.13 75.48,34.13 75.72,35.82 76.72,35.82 77.72,35.82 70.72,35.82 66.72,35.82 65.72,35.82 64.72,35.82 65.72,33.82 66.72,33.82 64.72,33.82 64.72,30.82 65.72,30.82 66.72,30.82 58.72,35.82 53.72,35.82 52.72,35.82 51.72,35.82 53.72,43.82 43.13,41.49 45.13,41.49 47.13,37.49 42.61,37.9 39.61,38.9 39.61,39.9 38.61,39.9 38.61,40.9 43.13,40.49 45.13,40.49 46.13,41.49 46.13,42.49 41.53,45.09 39.13,42.49 37.13,35.49 38.13,35.49 34.13,35.49 35.13,35.49 41.51,35.41 41.51,33.41 41.51,32.41 46.51,31.41 46.51,35.41 49.51,35.41 49.51,37.41 49.51,38.41 50.51,40.41 52.51,40.41 56.51,40.41 57.72,33.82 52.72,32.82 51.72,32.82 50.72,32.82 49.72,32.82 56.72,31.82 57.72,31.82 58.72,31.82 57.72,28.82 58.72,28.82 56.72,28.82 53.72,28.82 52.72,28.82 51.72,28.82 45.51,31.41 44.51,31.41 44.51,28.41 45.51,28.41 46.51,28.41 47.51,28.41 29.51,21.41 29.51,18.41 32.51,21.41 32.51,18.41 11.51,31.41 11.51,30.41 12.51,29.41 80.48,23.13 81.48,26.13 76.48,26.13 74.48,24.13 74.48,25.13 75.48,25.13 75.48,26.13 58.48,23.13 59.48,23.13 58.48,24.13 57.48,24.13 57.48,25.13 55.48,23.13 55.48,22.13 55.48,21.13 56.48,21.13 56.48,22.13 57.48,21.13 85.72,56.25 88.22,55.53 79.12,71.1 77.12,71.1 75.8,72.39 78.8,72.39 75.8,69.39 74.8,74.39 73.8,74.39 72.02,76.07 69.02,76.07 67.51,74.49 68.02,76.07 67.02,76.07 66.51,74.49 65.51,74.49 27.14,76.6 27.14,78.6 26.14,78.6 23.14,78.6 25.14,74.6 21.14,75.6 21.14,73.6 22.14,73.6 30.14,78.6 31.14,76.6 28.14,80.6 31.14,81.6 30.14,81.6 31.14,78.6 32.14,78.6 33.14,79.6 33.14,78.6 34.14,79.6 32.14,81.6 32.14,82.6 33.14,82.6 38.14,82.6 38.14,79.6 39.14,83.6 38.14,83.6 39.14,84.6 40.14,84.6 45.14,84.6 40.14,85.6 41.14,85.6 41.14,86.6 42.14,86.6 42.14,87.6 42.14,88.6 41.14,87.6 41.14,88.6 41.14,89.6 46.14,89.6 46.14,88.6 47.14,88.6 47.14,87.6 46.14,87.6 47.14,86.6 48.14,86.6 48.14,84.6 45.14,83.6 46.14,83.6 44.32,86.47 40.14,79.6 39.14,78.6 40.14,78.6 39.14,77.6 38.14,77.6 37.14,78.6 37.14,79.6 39.14,81.6 39.14,82.6 38.14,81.6 37.14,81.6 34.74,74.59 36.74,71.59 35.74,74.59 36.74,74.59 37.74,74.59 38.14,76.6 37.14,76.6 36.14,78.6 36.14,77.6 35.14,77.6 35.14,76.6 34.14,76.6 33.14,76.6 32.14,76.6 26.14,74.6 27.14,74.6 28.14,72.6 29.14,72.6 30.14,72.6 33.14,72.6 27.14,65.6 27.14,64.6 26.14,64.6 26.14,63.6 25.14,63.6 30.14,63.6 36.74,69.59 36.74,68.59 36.74,67.59 36.74,66.59 35.74,64.59 34.74,65.59 34.74,64.59 36.74,62.59 36.74,60.59 34.74,60.59 35.74,60.59 35.74,62.59 34.74,62.59 28.58,61.82 31.57,64.37 32.57,64.37 33.57,64.37 32.57,63.37 33.57,63.37 28.2,67.39 29.2,67.39 30.2,67.39 31.2,67.39 31.2,69.39 30.2,69.39 29.2,69.39 24.68,70.83 21.68,70.83 21.68,71.83 21.79,68.94 20.79,68.94 33.14,71.6 32.14,71.6 31.14,71.6 30.14,71.6 37.74,71.59 38.74,71.59 37.74,67.59 37.74,68.59 37.74,65.59 37.74,66.59 38.74,65.59 38.74,64.59 36.74,63.59 35.74,63.59 31.14,62.6 13.79,78.94 14.79,78.94 15.79,78.94 6.79,81.94 7.79,79.94 7.79,78.94 4.79,78.94 52.02,76.07 48.51,74.49 45.51,74.49 46.02,76.07 45.02,76.07 46.02,77.07 73.02,77.07 70.02,77.07 69.02,77.07 70.02,78.07 71.02,78.07 70.51,74.49 65.13,64.49 64.13,64.49 64.13,61.49
  pour Top: -4,-3.5 -4,96.5 arc-90 -1,99.5 93,99.5 arc-90 96,96.5 96,-3.5
  pour Bottom: 93,-4.5 -4,-4.5 arc-90 -7,-1.5 -7,99.5 arc-90 -4,102.5 93,102.5 arc-90 96,99.5 96,-1.5 arc-90
HB_LED
  Top 0.152: U2.18 33,74.76 33.5,75.26 83,75.26 83.62,74.63 83.62,74.13 86,71.76 R35.1
N$3  (via drill 0.3)
  Top 0.152: R2.2 v92,74.38
  Bottom 0.152: v92,74.38 POWER_5.0V.A
N$8
  Top 0.152: POWER_5.0V1.A 55,39.63 55.12,39.51 55.12,37.51 R3.2
N$9
  Top 0.152: R8.2 POWER_5.0V2.A
N$11  (via drill 0.3)
  Top 0.152: R9.1 v83,74.38
  Bottom 0.152: v83,74.38 L.A
N$12
  Top 0.152: C14.2 23,68.63 26.75,68.63 26.75,68.76 U2.30
N$13
  Top 0.152: C18.2 31.5,61.63 29.88,61.63 29.88,61.88 Y1.P$2 29.75,62.01 29,62.76 U2.2
N$14  (via drill 0.3)
  Top 0.152: R25.2 v89,74.38
  Bottom 0.152: v89,74.38 POWER_3.3V.A
N$15
  Top 0.152: C19.1 25.62,61.63 27.25,61.63 27.25,61.88 Y1.P$1 27.38,62.01 28.2,62.83 U2.1
N$20  (via drill 0.3)
  Top 0.152: R35.2 v86,74.38
  Bottom 0.152: v86,74.38 HEARTBEAT.A
OUT
  Top 0.152: 44,40.38 U5.5
  Top 0.254: JP2.1 44,40.38
PA10  (via drill 0.35)
  Top 0.152: v76.88,72.88 78,71.76 83,71.76 R9.2 | U2.13 37.6,70.41 v38,70.01 | v44,70.01 47,70.01 51,66.01 v57,66.01
  Bottom 0.152: v38,70.01 v44,70.01 | v57,66.01 66,66.01 70,70.01 70,72.01 71,73.01 76.75,73.01 v76.88,72.88
PUMP_D6_PA19  (via drill 0.3)
  Top 0.152: v31.62,72.88 31.62,74.01 31.5,74.13 U2.20 | v46.25,73.51 67.88,73.51 67.88,72.51 IC1.1
  Bottom 0.152: v31.62,72.88 32.25,73.51 v46.25,73.51
PUMP_GND  (via drill 0.35)
  Top 0.508: IC1.16 72.44,72.45 v72,72.01 | v65,45.01 62,42.01 v60,42.01 55.76,42.01 POWER_5.0V1.C | v59,33.01 60,34.01 v60,39.01 | v55,25.01 v55,33.01
  Bottom 0.508: v72,72.01 72,61.01 65,54.01 v65,45.01 | v55,33.01 v59,33.01 | v60,39.01 v60,42.01 | U$7.1 58,22.01 v55,25.01
PUMP_VCC  (via drill 0.35)
  Top 0.508: IC1.9 74.07,60.01 | 74.07,60.01 74.07,55.94 v75,55.01 | v22,34.01 14.12,34.01 13.8,33.69 13.09,33.69 JP3.2 13,31.01 24,20.01 v31,20.01 | v48,51.01 48,59.01 51,62.01 62,62.01 v63,63.01 | v68,60.01 74.07,60.01 | v32,34.01 v32,42.01 | U$7.2 88.5,25.01 77,25.01 71,19.01 v71,18.01
  Bottom 0.508: 84,52.01 78,52.01 v75,55.01 | 84,52.01 84.31,52.32 U$6.P1A | U$6.P1B 84.31,51.7 84,52.01 | v32,42.01 32,45.01 38,51.01 v48,51.01 | v63,63.01 65,63.01 v68,60.01 | v22,34.01 v32,34.01 | v31,20.01 51,20.01 54,17.01 70,17.01 v71,18.01
SCL  (via drill 0.3, 0.35)
  Top 0.152: v29.72,75.45 29.72,74.23 U2.22 | U$4.P4 87.02,41.16 87.02,42.22 90.37,45.58 90.37,54.26 88.54,56.09 87.02,56.09 U$10.P4 86.87,56.25 86.56,56.25 85.19,57.62 78.49,57.62 75.29,54.42 59.41,54.42 v57,52.01 | 13.87,50.3 13.87,48.47 9.14,43.75 U$13.P4 | 13.87,50.3 13.87,55.64 12.95,56.55 11.73,56.55 11.58,56.7 11.58,58.07 12.34,58.84 12.34,59.6 R6.1 | 13.87,50.3 49.71,50.3 v50,50.01
  Bottom 0.152: v29.72,75.45 24.38,75.45 22.25,77.58 10.97,77.58 9.14,75.75 U$12.P4 9.14,75.6 9.91,74.84 9.91,61.73 9.14,60.97 9.14,59.75 U$11.P4 9.14,59.6 9.14,58.23 9.91,57.46 9.91,53.35 8.08,51.52 8.08,44.66 8.99,43.75 U$13.P4 | v57,52.01 55,50.01 v50,50.01
SDA  (via drill 0.3)
  Top 0.152: 11.73,66 9.14,68.59 9.14,73.01 U$12.P5 | 11.73,66 13.56,64.17 13.56,59.45 12.5,58.38 12.5,57.46 R5.1 | v30.48,75.45 30.48,74.23 U2.21 | U$4.P5 86.87,38.72 86.87,39.94 86.11,40.7 86.11,52.74 86.87,53.5 U$10.P5 | 11.73,66 8.84,63.1 8.69,63.1 8.08,62.49 8.08,58.07 8.99,57.16 U$11.P5
  Bottom 0.152: v30.48,75.45 28.04,77.89 10.06,77.89 8.69,76.51 8.53,76.51 8.08,76.06 8.08,74.08 8.99,73.16 U$12.P5 | U$11.P5 8.99,57.01 7.77,55.79 7.77,43.44 8.99,42.22 8.99,41.16 U$13.P5 9.14,41.01 11.73,38.41 29.26,38.41 32.46,41.61 35.2,41.61 40.39,36.43 80.31,36.43 82.45,38.57 86.87,38.57 U$4.P5
SWCLK
  Top 0.152: U2.31 26.67,67.98 24.84,67.98 19.2,62.34 15.85,62.34 12.42,65.77 12.42,68.2 13.87,69.66 JP4.4
  Bottom 0.152: SWC.TP 18.9,64.93 15.85,64.93 13.26,62.34 12.8,62.34 12.34,62.8 12.34,68.13 13.87,69.66 JP4.4
SWDIO  (via drill 0.3, 0.35)
  Top 0.152: v19,58.51 26.75,66.26 26.75,67.13 U2.32 | v16,63.01 14,65.01 14,68.34 JP4.2
  Bottom 0.152: v19,58.51 19,57.01 | 19,57.01 SWD.TP | 19,57.01 17,57.01 16,58.01 v16,63.01
VALVE_D5_PA15  (via drill 0.35)
  Top 0.152: IC1.2 67.88,71.26 66.25,71.26 v64,69.01 | U2.16 39.2,72.81 v40,72.01 | v44,72.01 47,72.01 50,69.01 v51,69.01
  Bottom 0.152: v40,72.01 v44,72.01 | v51,69.01 v64,69.01
VALVE_GND  (via drill 0.35)
  Top 0.508: v76,40.01 74.24,38.25 POWER_5.0V2.C | IC1.15 75.83,71.18 82,65.01 v82,64.01 | v82,45.63 81,46.63 v81,55.01
  Bottom 0.508: U$6.P2A U$6.P2B v82,45.63 78.62,45.63 76,43.01 v76,40.01 | v81,55.01 82,56.01 v82,64.01
VBUS  (via drill 0.35)
  Top 0.508: D2.A 51.64,58.65 v52,59.01 | v47,85.01 44.3,87.71 CN1.VBUS
  Bottom 0.508: v52,59.01 52,63.01 47,68.01 v47,85.01
VDDANA1  (via drill 0.3)
  Top 0.152: 35.25,66.51 35.25,67.13 U2.9 | 35.25,66.51 35.25,66.38 38,63.63 C15.1 | v25.12,71.76 23,71.76 L2.2 | 35.25,66.51 v33.88,67.88
  Bottom 0.152: v25.12,71.76 25.41,71.76 28.94,68.22 33.53,68.22 v33.88,67.88
VOUT  (via drill 0.35)
  Top 0.152: JP1.2 41.5,37.01
  Top 0.254: 41.5,37.01 43.35,37.01 U5.1 43,38.76 v43,39.01 41.25,39.01 41.25,39.81 C6.1 | D2.C 47.36,39.01 v47,39.01 45.95,37.96 U5.3
  Bottom 0.254: v47,39.01 v43,39.01

### Text on the board
tPlace: Pressure / Sensor | Sensor | Valve | Pump / State | Valve / State | Cuff/Pump | Pump | + -